# Altium schematic sheet 3.3V_Buck_Schematic.SchDoc
size A; SheetNumber: 1; SheetTotal: 1
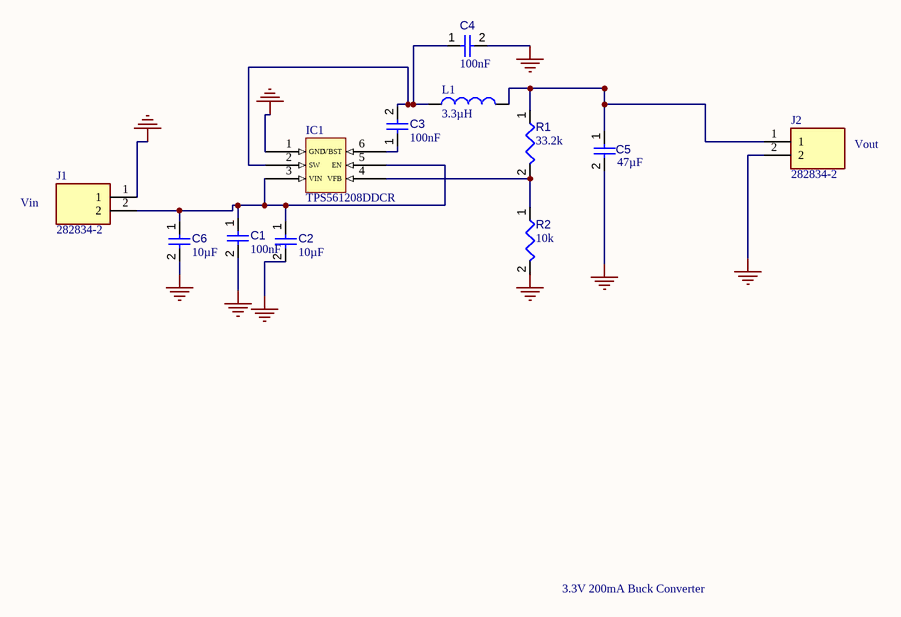
[diagram p0: 3.3V_Buck_Schematic.SchDoc]

## Parts
C1  value 100nF  [CAPC1005X56X25LL10T15]  (hidden comment: Capacitor 0.1 uF +/- 5% 16 V 0402)
C2  value 10µF  [CAPC2012X14N]  (hidden comment: MSAST21GBB5106MTNA01)
C3  value 100nF  [CAPC2012X06N]  (hidden comment: 08053C104KAT2A)
C4  value 100nF  [CAPC1005X56X25LL10T15]  (hidden comment: Capacitor 0.1 uF +/- 5% 16 V 0402)
C5  value 47µF  [CAPC3225X27N]  (hidden comment: GRM32ER61C476KE15L)
C6  value 10µF  [CAPC2012X14N]  (hidden comment: MSAST21GBB5106MTNA01)
IC1  TPS561208DDCR  [SOT95P245X110-6N]
J1  282834-2  [TE_282834-2]
J2  282834-2  [TE_282834-2]
L1  value 3.3µH  [INDP3225X24N]  (hidden comment: NLCV32T-3R3M-PFR)
R1  value 33.2k  [CAPC2012X07N]  (hidden comment: ERJ-6ENF3322V)
R2  value 10k  [RESC3216X60X45ML15T20]  (hidden comment: Resistor 10k +/-1% 1206 250 mW)

## Nets
GND: C1.2 C2.2 C4.2 C5.2 C6.2 IC1.1(GND) J1.1 J2.2 R2.2
NetC1_1: C1.1 C2.1 C6.1 IC1.3(VIN) IC1.5(EN) J1.2
NetC3_1: C3.1 IC1.6(VBST)
NetC3_2: C3.2 C4.1 IC1.2(SW) L1.1
NetC5_1: C5.1 J2.1 L1.2 R1.1
NetIC1_4: IC1.4(VFB) R1.2 R2.1

## Notes on the sheet
- Vout
- Vin
- 3.3V 200mA Buck Converter

## Library data of the parts
C1 C4 = CMP-001-00001-6: Chip Capacitor, 0.1 uF, +/- 5%, 16 V, 0402 (1005 Metric); Capacitor Type: Ceramic; Voltage Rating: 16V; Max Operating Temperature: 125°C; Min Operating Temperature: -55°C; Case/Package: 0402; Mounting Technology: SM; Pins: 2; Tolerance: 5%; RoHS Compliant: True
C2 C6 = CMP-001-00084-1: Ceramic Capacitor, Multilayer, Ceramic, 25V, 20% +Tol, 20% -Tol, X5R, 15% TC, 10uF, Surface Mount, 0805; Min Operating Temperature: -55°C; Height: 1.25mm; Width: 1.25mm; Length: 2mm; Max Operating Temperature: 85°C; Mounting Technology: Surface Mount
C3 = CMP-001-00085-1: 0805 100 nF 25V ±10 % Tolerance X7R Surface Mount Multilayer Ceramic Capacitor; Tolerance: 10%; Case/Package: 0805; Dielectric: X7R; Voltage Rating (DC): 25V; Number of Terminals: 2; Voltage Rating: 25V; Dielectric Material: Ceramic; Depth: 1.25mm; Height: 940µm; Max Operating Temperature: 125°C; Width: 1.25mm; Mounting Technology: Surface Mount; Pins: 2; Min Operating Temperature: -55°C; Thickness: 939.8µm
C5 = CMP-001-00086-1: Capacitor: ceramic; MLCC; 47uF; 16V; X5R; ±10%; SMD; 1210; Series: GRM; Case/Package: 1210; Length: 3.2mm; Min Operating Temperature: -55°C; Max Operating Temperature: 85°C; Mounting Technology: Surface Mount; Voltage Rating: 16V; Depth: 2.5mm; Width: 2.5mm; Voltage: 16V; Tolerance: 10%; Height: 2.5mm; Pins: 2
IC1 = CMP-019-00049-1: 4.5V to 17V Input, 1A Output, Synchronous Step-Down Converter 6-SOT-23-THIN -40 to 125; Manufacturer Lifecycle Status: ACTIVE; Max Duty Cycle: 75%; Switching Frequency: 580kHz; Nominal Supply Current: 590µA; Topology: Buck; Output Voltage: 1.05V; Max Junction Temperature (Tj): 125°C; Min Supply Voltage: 4.5V; Width: 1.6mm; Pins: 6; Min Operating Temperature: -40°C; Max Operating Temperature: 85°C; Output Current: 1A; RoHS: Compliant; Thickness: 870µm; Length: 2.9mm; Height: 1.1mm; Max Supply Voltage: 17V; Lifecycle Status: Production; Schedule B: 8542390000, 8542390000; Case/Package: SOT-23-6
J1 J2 = CMP-002-00072-1: Terminal Block Connector PCB 2.54 mm 30-16 AWG Green 10 A 150 V M1.6; Centerline_Pitch: 2.54 mm[.1 in]; MF: TE Connectivity; Number_of_Positions: 2; Pins: 2; Component Type: Standard; Value: *; Design Item ID: 282834-2; MP: 282834-2; Check_prices: https://www.snapeda.com/parts/282834-2/TE+Connectivity+AMP+Connectors/view-part/?ref=eda; Case/Package: None; Source: 282834-2.SchLib; SnapEDA_Link: https://www.snapeda.com/parts/282834-2/TE+Connectivity+AMP+Connectors/view-part/?ref=snap; EU_RoHS_Compliance: Compliant with Exemptions
L1 = CMP-006-00023-1: Inductor Power Unshielded Wirewound 3.3uH 20% 7.96MHz 15Q-Factor Ferrite 1A 192mOhm DCR 1210 T/R; Self Resonant Frequency: 54MHz; Tolerance: 20%; Pins: 2; Case/Package: 1210; Current Rating: 1A; Min Operating Temperature: -40°C; Max Current Rating: 1A; Width: 2.5mm; Mounting Technology: Surface Mount; Depth: 2.7mm; Max Operating Temperature: 125°C; Length: 3.2mm; Height: 2.2mm
R1 = CMP-009-00179-1: Res Thick Film 0805 33.2K Ohm 1% 0.125W(1/8W) ±100ppm/°C Molded SMD Punched Carrier T/R; Voltage Rating: 150V; Height: 600µm; Min Operating Temperature: -55°C; Max Operating Temperature: 155°C; Weight: 5.499807mg; Length: 2mm; Case/Package: 0805; Mounting Technology: Surface Mount; Width: 1.25mm; Depth: 1.25mm; Tolerance: 1%
R2 = CMP-009-00016-5: Chip Resistor, 10 KOhm, +/- 1%, 0.25 W, -55 to 155 degC, 1206 (3216 Metric); Power: 250mW; Voltage Rating: 200V; Pins: 2; Max Operating Temperature: 155°C; Tolerance: 1%; RoHS Compliant: True; Case/Package: 1206; Min Operating Temperature: -55°C; Mounting Technology: SM